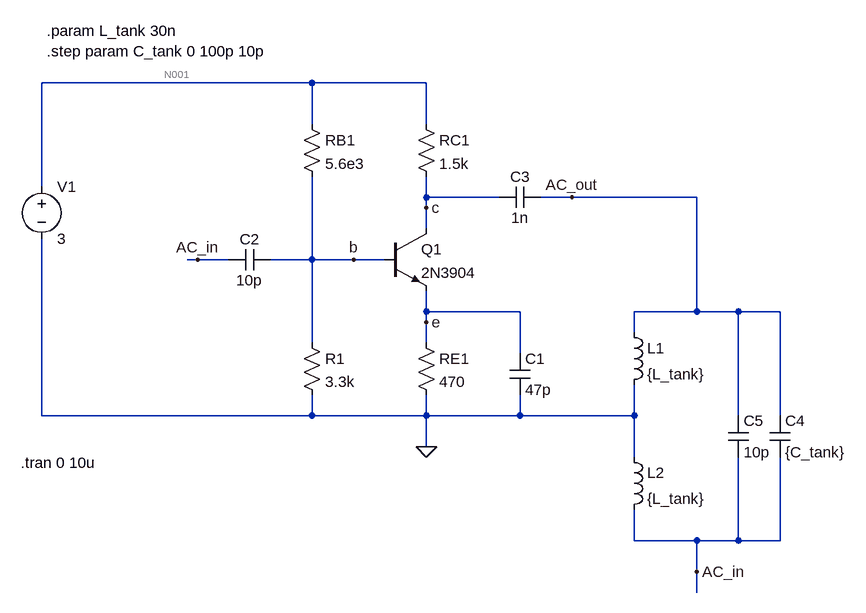
[diagram p0: schematic 02-Common_self-biasing_tapped-inductor.asc]
02-Common_self-biasing_tapped-inductor.asc, the LTspice schematic file:
Version 4
SHEET 1 1016 680
WIRE 176 -176 -240 -176
WIRE 352 -176 176 -176
WIRE 176 -112 176 -176
WIRE 352 -112 352 -176
WIRE -240 -16 -240 -176
WIRE 352 0 352 -32
WIRE 464 0 352 0
WIRE 576 0 528 0
WIRE 768 0 576 0
WIRE 352 16 352 0
WIRE 352 48 352 16
WIRE 0 96 -16 96
WIRE 48 96 0 96
WIRE 176 96 176 -32
WIRE 176 96 112 96
WIRE 240 96 176 96
WIRE 288 96 240 96
WIRE 352 176 352 144
WIRE 496 176 352 176
WIRE 768 176 768 0
WIRE 768 176 672 176
WIRE 832 176 768 176
WIRE 896 176 832 176
WIRE 352 192 352 176
WIRE 672 208 672 176
WIRE 176 224 176 96
WIRE 352 224 352 192
WIRE 496 240 496 176
WIRE -240 336 -240 64
WIRE 176 336 176 304
WIRE 176 336 -240 336
WIRE 352 336 352 304
WIRE 352 336 176 336
WIRE 496 336 496 304
WIRE 496 336 352 336
WIRE 672 336 672 288
WIRE 672 336 496 336
WIRE 832 336 832 176
WIRE 896 336 896 176
WIRE 352 384 352 336
WIRE 672 400 672 336
WIRE 672 528 672 480
WIRE 768 528 672 528
WIRE 832 528 832 400
WIRE 832 528 768 528
WIRE 896 528 896 400
WIRE 896 528 832 528
WIRE 768 576 768 528
WIRE 768 608 768 576
FLAG 352 192 e
FLAG 352 16 c
FLAG 352 384 0
FLAG 240 96 b
FLAG 0 96 AC_in
FLAG 576 0 AC_out
FLAG 768 576 AC_in
SYMBOL voltage -240 -32 R0
WINDOW 123 0 0 Left 0
WINDOW 39 0 0 Left 0
SYMATTR InstName V1
SYMATTR Value 3
SYMBOL res 336 -128 R0
SYMATTR InstName RC1
SYMATTR Value 1.5k
SYMBOL npn 288 48 R0
SYMATTR InstName Q1
SYMATTR Value 2N3904
SYMBOL res 336 208 R0
SYMATTR InstName RE1
SYMATTR Value 470
SYMBOL res 160 -128 R0
SYMATTR InstName RB1
SYMATTR Value 5.6e3
SYMBOL res 160 208 R0
SYMATTR InstName R1
SYMATTR Value 3.3k
SYMBOL cap 480 240 R0
SYMATTR InstName C1
SYMATTR Value 47p
SYMBOL cap 112 80 R90
WINDOW 0 0 32 VBottom 2
WINDOW 3 32 32 VTop 2
SYMATTR InstName C2
SYMATTR Value 10p
SYMBOL cap 528 -16 R90
WINDOW 0 0 32 VBottom 2
WINDOW 3 32 32 VTop 2
SYMATTR InstName C3
SYMATTR Value 1n
SYMBOL ind 656 192 R0
SYMATTR InstName L1
SYMATTR Value {L_tank}
SYMBOL ind 656 384 R0
SYMATTR InstName L2
SYMATTR Value {L_tank}
SYMBOL cap 880 336 R0
SYMATTR InstName C4
SYMATTR Value {C_tank}
SYMBOL cap 816 336 R0
SYMATTR InstName C5
SYMATTR Value 10p
TEXT -272 408 Left 2 !.tran 0 10u
TEXT -232 -256 Left 2 !.param L_tank 30n\n.step param C_tank 0 100p 10p

The netlist it stands for:
* 02-Common_self-biasing_tapped-inductor.asc
V1 N001 0 3
RC1 N001 c 1.5k
Q1 c b e 0 2N3904
RE1 e 0 470
RB1 N001 b 5.6e3
R1 b 0 3.3k
C1 e 0 47p
C2 b AC_in 10p
C3 AC_out c 1n
L1 AC_out 0 {L_tank}
L2 0 AC_in {L_tank}
C4 AC_out AC_in {C_tank}
C5 AC_out AC_in 10p
.model NPN NPN
.model PNP PNP
.lib standard.bjt
.tran 0 10u
.param L_tank 30n
.step param C_tank 0 100p 10p
.backanno
.end

* Results of the author's LTspice run, read from the files saved beside the schematic
* Operating Point (first step), zero values left out:
*   V(n001) = 3 V
*   V(c) = 1.563 V
*   V(b) = 1.106 V
*   V(e) = 451.6 mV
*   Ic(Q1) = 957.7 µA
*   Ib(Q1) = 3.186 µA
*   Ie(Q1) = -960.9 µA
*   I(R1) = 335.1 µA
*   I(Rb1) = 338.3 µA
*   I(Re1) = 960.9 µA
*   I(Rc1) = 957.7 µA
*   I(V1) = -1.296 mA